# Altium schematic sheet ActuatorMKII_Connectors.SchDoc: Connectors
size B; Date: 09/17/2022; Author: Dylan Trainor; Organization: ORGANIZATION; Address1: ADDRESS 1; Address2: ADDRESS 2; Address3: ADDRESS 3; Address4: ADDRESS 4; DocumentNumber: 1; Revision: -; SheetNumber: 5; SheetTotal: 9; ENG_APP_DATE: --/--/--; DSN_APP_DATE: --/--/--; CHK_APP_DATE: --/--/--
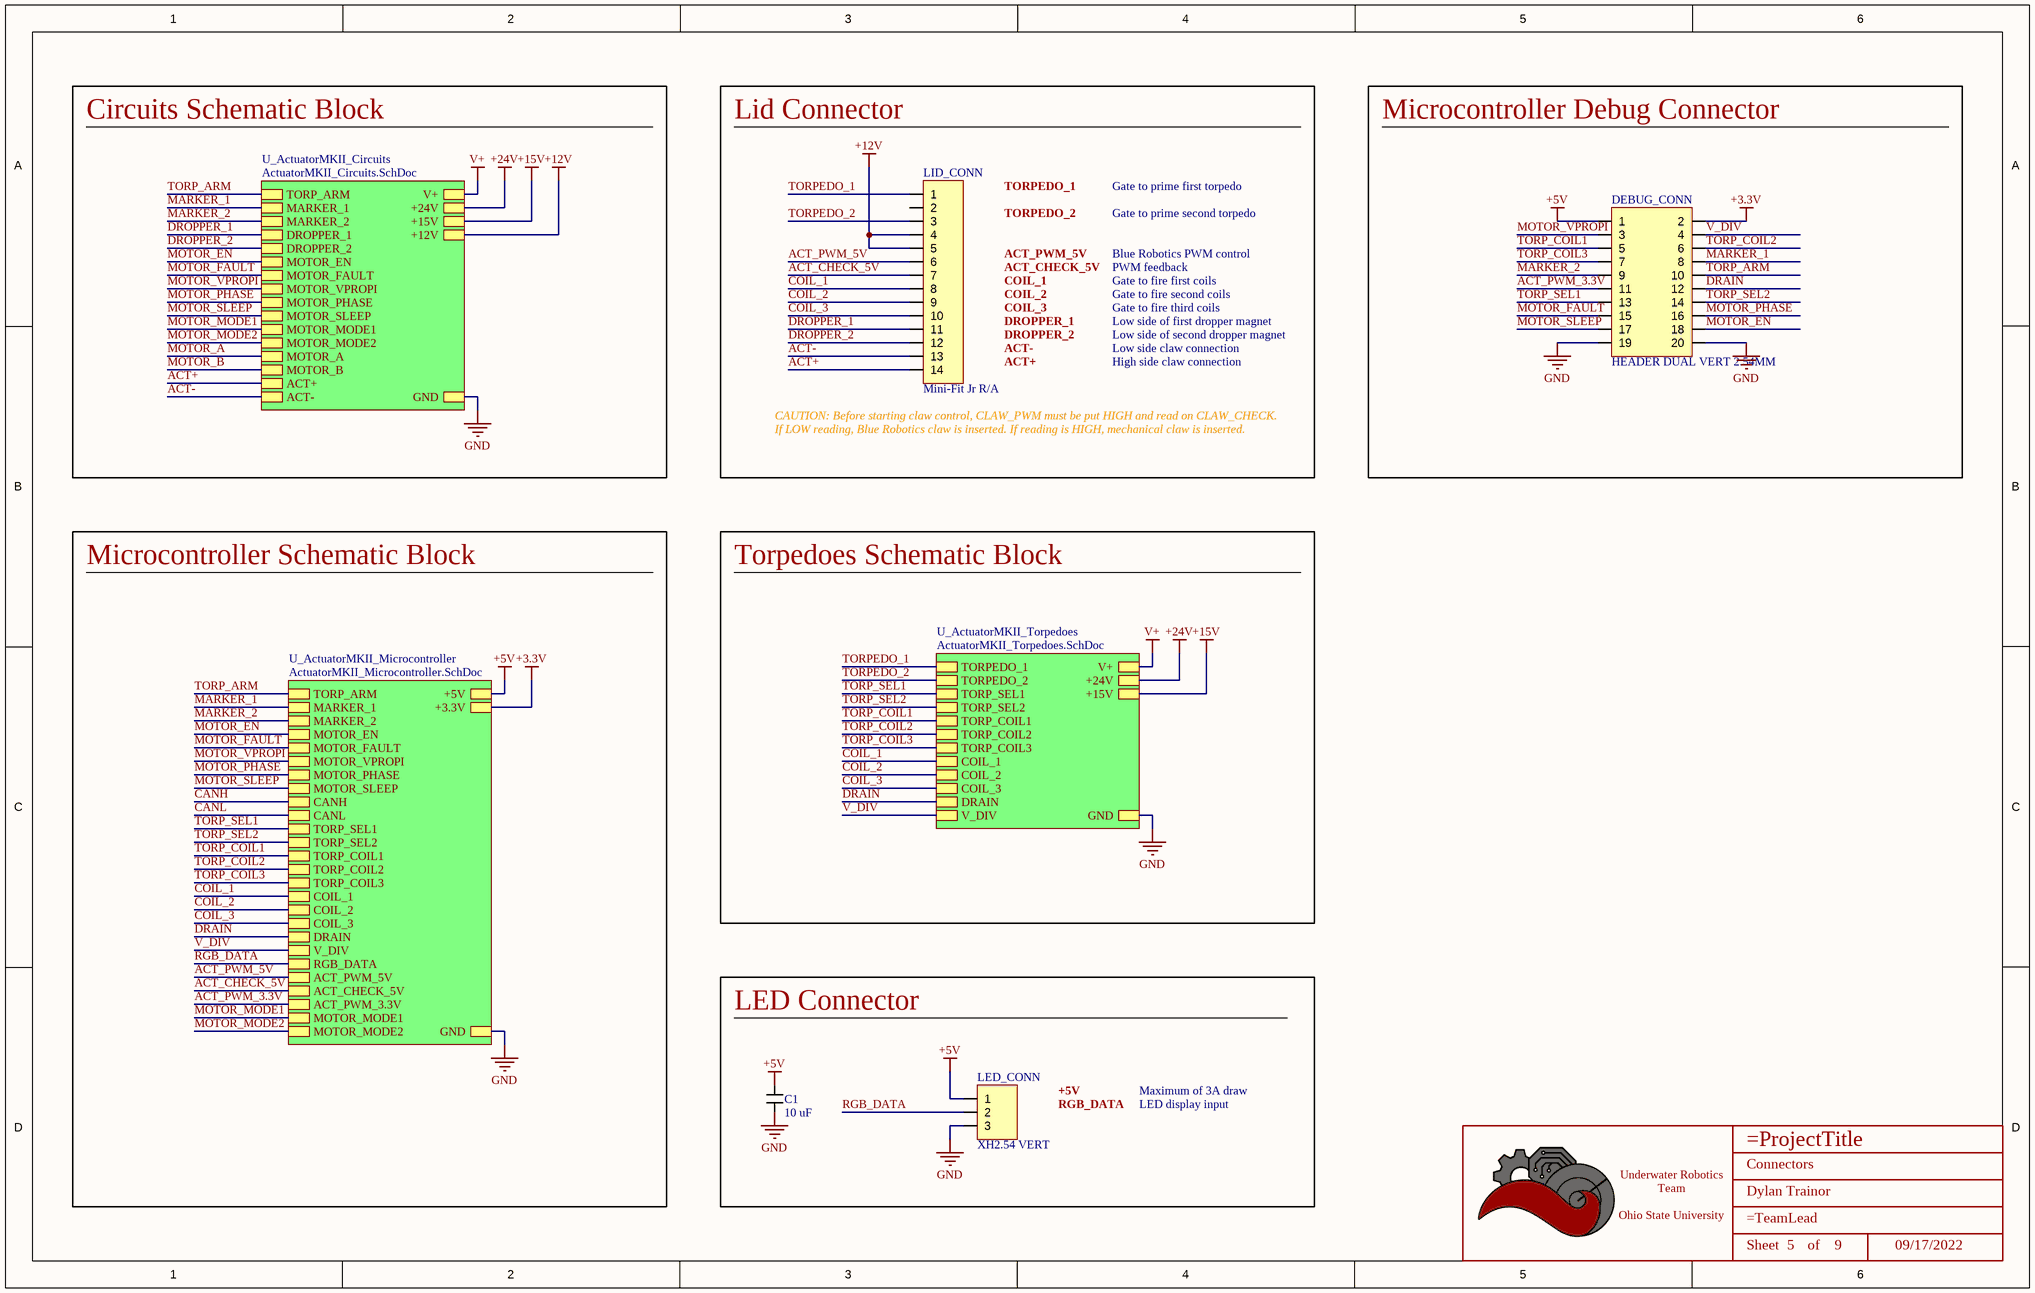
[diagram p0: ActuatorMKII_Connectors.SchDoc]

## Parts
*  Title_Block  [LOGO]  (value not drawn)  (graphical)
C1  Value (uF): 10 uF  [CAPACITOR_0603]  (hidden comment: 10uF Ceramic 6.3V)
DEBUG_CONN  HEADER DUAL VERT 2.54MM  [HEADER_2x10PIN_2.54MM]
LED_CONN  XH2.54 VERT  [CONN_JST_XH254_3POS_VERT]
LID_CONN  Mini-Fit Jr R/A  [CONN_MOLEX_MINIFIT JR_14 POS_R/A]

## Blocks framed on the sheet
Lid Connector: LID_CONN
Microcontroller Debug Connector: DEBUG_CONN
LED Connector: C1 LED_CONN

## Sub-sheets
U_ActuatorMKII_Circuits = ActuatorMKII_Circuits.SchDoc: V+, +15V, +12V, +24V, GND, TORP_ARM, MARKER_1, MARKER_2, DROPPER_1, DROPPER_2, MOTOR_EN, MOTOR_FAULT, MOTOR_VPROPI, MOTOR_PHASE, MOTOR_SLEEP, MOTOR_MODE1, MOTOR_MODE2, MOTOR_A, MOTOR_B, ACT+, ACT-
U_ActuatorMKII_Microcontroller = ActuatorMKII_Microcontroller.SchDoc: GND, +5V, +3.3V, TORP_ARM, MARKER_1, MARKER_2, MOTOR_EN, MOTOR_FAULT, MOTOR_VPROPI, MOTOR_PHASE, MOTOR_SLEEP, CANH, CANL, TORP_SEL1, TORP_SEL2, TORP_COIL1, TORP_COIL2, TORP_COIL3, COIL_1, COIL_2, COIL_3, DRAIN, V_DIV, RGB_DATA, ACT_PWM_5V, ACT_CHECK_5V, ACT_PWM_3.3V, MOTOR_MODE1, MOTOR_MODE2
U_ActuatorMKII_Torpedoes = ActuatorMKII_Torpedoes.SchDoc: V+, +15V, +24V, GND, TORPEDO_1, TORPEDO_2, TORP_SEL1, TORP_SEL2, TORP_COIL1, TORP_COIL2, TORP_COIL3, COIL_1, COIL_2, COIL_3, DRAIN, V_DIV

## Nets
+3.3V: DEBUG_CONN.2 ; sheet U_ActuatorMKII_Microcontroller/+3.3V
+5V: C1.1 DEBUG_CONN.1 LED_CONN.1 ; sheet U_ActuatorMKII_Microcontroller/+5V
+12V: LID_CONN.4 LID_CONN.5 ; sheet U_ActuatorMKII_Circuits/+12V
+15V: sheet U_ActuatorMKII_Circuits/+15V, sheet U_ActuatorMKII_Torpedoes/+15V
+24V: sheet U_ActuatorMKII_Circuits/+24V, sheet U_ActuatorMKII_Torpedoes/+24V
GND: C1.2 DEBUG_CONN.19 DEBUG_CONN.20 LED_CONN.3 ; sheet U_ActuatorMKII_Circuits/GND, sheet U_ActuatorMKII_Torpedoes/GND, sheet U_ActuatorMKII_Microcontroller/GND
V+: sheet U_ActuatorMKII_Circuits/V+, sheet U_ActuatorMKII_Torpedoes/V+
ACT+: LID_CONN.14 ; sheet U_ActuatorMKII_Circuits/ACT+
ACT-: LID_CONN.13 ; sheet U_ActuatorMKII_Circuits/ACT-
ACT_CHECK_5V: LID_CONN.7 ; sheet U_ActuatorMKII_Microcontroller/ACT_CHECK_5V
ACT_PWM_3.3V: DEBUG_CONN.11 ; sheet U_ActuatorMKII_Microcontroller/ACT_PWM_3.3V
ACT_PWM_5V: LID_CONN.6 ; sheet U_ActuatorMKII_Microcontroller/ACT_PWM_5V
CANH: sheet U_ActuatorMKII_Microcontroller/CANH
CANL: sheet U_ActuatorMKII_Microcontroller/CANL
COIL_1: LID_CONN.8 ; sheet U_ActuatorMKII_Torpedoes/COIL_1, sheet U_ActuatorMKII_Microcontroller/COIL_1
COIL_2: LID_CONN.9 ; sheet U_ActuatorMKII_Torpedoes/COIL_2, sheet U_ActuatorMKII_Microcontroller/COIL_2
COIL_3: LID_CONN.10 ; sheet U_ActuatorMKII_Torpedoes/COIL_3, sheet U_ActuatorMKII_Microcontroller/COIL_3
DRAIN: DEBUG_CONN.12 ; sheet U_ActuatorMKII_Torpedoes/DRAIN, sheet U_ActuatorMKII_Microcontroller/DRAIN
DROPPER_1: LID_CONN.11 ; sheet U_ActuatorMKII_Circuits/DROPPER_1
DROPPER_2: LID_CONN.12 ; sheet U_ActuatorMKII_Circuits/DROPPER_2
MARKER_1: DEBUG_CONN.8 ; sheet U_ActuatorMKII_Circuits/MARKER_1, sheet U_ActuatorMKII_Microcontroller/MARKER_1
MARKER_2: DEBUG_CONN.9 ; sheet U_ActuatorMKII_Circuits/MARKER_2, sheet U_ActuatorMKII_Microcontroller/MARKER_2
MOTOR_A: sheet U_ActuatorMKII_Circuits/MOTOR_A
MOTOR_B: sheet U_ActuatorMKII_Circuits/MOTOR_B
MOTOR_EN: DEBUG_CONN.18 ; sheet U_ActuatorMKII_Circuits/MOTOR_EN, sheet U_ActuatorMKII_Microcontroller/MOTOR_EN
MOTOR_FAULT: DEBUG_CONN.15 ; sheet U_ActuatorMKII_Circuits/MOTOR_FAULT, sheet U_ActuatorMKII_Microcontroller/MOTOR_FAULT
MOTOR_MODE1: sheet U_ActuatorMKII_Circuits/MOTOR_MODE1, sheet U_ActuatorMKII_Microcontroller/MOTOR_MODE1
MOTOR_MODE2: sheet U_ActuatorMKII_Circuits/MOTOR_MODE2, sheet U_ActuatorMKII_Microcontroller/MOTOR_MODE2
MOTOR_PHASE: DEBUG_CONN.16 ; sheet U_ActuatorMKII_Circuits/MOTOR_PHASE, sheet U_ActuatorMKII_Microcontroller/MOTOR_PHASE
MOTOR_SLEEP: DEBUG_CONN.17 ; sheet U_ActuatorMKII_Circuits/MOTOR_SLEEP, sheet U_ActuatorMKII_Microcontroller/MOTOR_SLEEP
MOTOR_VPROPI: DEBUG_CONN.3 ; sheet U_ActuatorMKII_Circuits/MOTOR_VPROPI, sheet U_ActuatorMKII_Microcontroller/MOTOR_VPROPI
RGB_DATA: LED_CONN.2 ; sheet U_ActuatorMKII_Microcontroller/RGB_DATA
TORP_ARM: DEBUG_CONN.10 ; sheet U_ActuatorMKII_Circuits/TORP_ARM, sheet U_ActuatorMKII_Microcontroller/TORP_ARM
TORP_COIL1: DEBUG_CONN.5 ; sheet U_ActuatorMKII_Torpedoes/TORP_COIL1, sheet U_ActuatorMKII_Microcontroller/TORP_COIL1
TORP_COIL2: DEBUG_CONN.6 ; sheet U_ActuatorMKII_Torpedoes/TORP_COIL2, sheet U_ActuatorMKII_Microcontroller/TORP_COIL2
TORP_COIL3: DEBUG_CONN.7 ; sheet U_ActuatorMKII_Torpedoes/TORP_COIL3, sheet U_ActuatorMKII_Microcontroller/TORP_COIL3
TORP_SEL1: DEBUG_CONN.13 ; sheet U_ActuatorMKII_Torpedoes/TORP_SEL1, sheet U_ActuatorMKII_Microcontroller/TORP_SEL1
TORP_SEL2: DEBUG_CONN.14 ; sheet U_ActuatorMKII_Torpedoes/TORP_SEL2, sheet U_ActuatorMKII_Microcontroller/TORP_SEL2
TORPEDO_1: LID_CONN.1 ; sheet U_ActuatorMKII_Torpedoes/TORPEDO_1
TORPEDO_2: LID_CONN.3 ; sheet U_ActuatorMKII_Torpedoes/TORPEDO_2
V_DIV: DEBUG_CONN.4 ; sheet U_ActuatorMKII_Torpedoes/V_DIV, sheet U_ActuatorMKII_Microcontroller/V_DIV

Not connected (* = marked no-connect by the designer): LID_CONN 2

## Notes on the sheet
- Circuits Schematic Block
- TORPEDO_1
- TORPEDO_2
- Gate to prime first torpedo
- Gate to prime second torpedo
- ACT_PWM_5V
- ACT_CHECK_5V
- COIL_1
- COIL_2
- Blue Robotics PWM control
- PWM feedback
- Gate to fire first coils
- Gate to fire second coils
- DROPPER_1
- DROPPER_2
- ACT+
- ACT-
- COIL_3
- Low side of first dropper magnet
- Low side of second dropper magnet
- High side claw connection
- Low side claw connection
- Gate to fire third coils
- (near LID_CONN) CAUTION: Before starting claw control, CLAW_PWM must be put HIGH and read on CLAW_CHECK.
- If LOW reading, Blue Robotics claw is inserted. If reading is HIGH, mechanical claw is inserted.
- Microcontroller Schematic Block
- Torpedoes Schematic Block
- RGB_DATA
- +5V
- LED display input
- Maximum of 3A draw
- DWG. NO.
- REV.
- SHT.
- THIS DOCUMENT AND THE DATA DISCLOSED HEREIN OR HEREWITH IS THE PROPERTY OF ALTIUM LIMITED AND MAY BE FREELY DISTRIBUTED IN WHOLE. NO RIGHTS ARE RESERVED OR EXPRESS OR IMPLIED WARANTEE GIVEN.
- REVISION
- DESCRIPTION
- DATE
- APPROVED
- ENG:
- APPROVALS
- PROJECT
- DSN:
- CHK:
- REFERENCE DOCUMENTS
- PROJECT REVISION:
- TITLE
- DOCUMENT REVISION:
- DESIGN ITEM:
- BOM:
- FAB DWG:
- PCB DWG:
- ASSY DWG:
- SCALE:
- SIZE
- B
- CAGE CODE
- FILE NAME
- DWG NO.
- SHEET
- OF
- REV
- (in symbol Title_Block) Underwater Robotics Team / Ohio State University; Sheet; of

## Library data of the parts
* = Title_Block: UWRT Schematic Title Block Template / Created June 2021, Dylan Trainor
C1 = CAPACITOR_10uF_0603: Cap 10uF 6.3V +/-20% / Ceramic 0603; Made By: Flip B; ComponentLink1Description: Digikey; ComponentLink1URL: https://www.digikey.com/en/products/detail/samsung-electro-mechanics/CL10A106MQ8NNNC/3886777; Supplier 1: Digi-Key; Supplier Part Number 1: 1276-1119-1-ND; Tolerance: +/- 20%; Voltage: 6.3V
DEBUG_CONN = HEADER_2x10PIN_2.54MM: CONN HEADER VERT 20POS 2.54MM; Made By: Tyson Nguyen; Supplier 1: Digi-Key; Supplier Part Number 1: Z8747-ND
LED_CONN = CONN_JST_XH254_3POS_VERT: JST XH 2.54mm Pitch 3 Pos Vertical; Current Per Pin: 4A; Number of Positions: 3; NOTE: Do not use JST 2.5mm parts with this footprint. JST does not make 2.54mm pitch pins, rather only clones make this connector!; Manufacturer: JST; Pitch: 2.54mm; Configuration: Vertical; Color: White; Created By: Robert P; Series: XH 2.54; ComponentLink1Description: Purchase Link; ComponentLink1URL: https://www.amazon.com/460PCS-XH2-54-Connector-Terminal-Connectors/dp/B09DBGVX5C
LID_CONN = CONN_MOLEX_MINIFIT JR_14POS_R/A: Molex Minifit Jr. 5569 / 14 Pos R/A Natural; Pitch: 4.2mm; Configuration: Right Angle; Current Per Pin: 13A; Number of Positions: 14; Manufacturer: Molex; Color: Natural; Created By: Flip B; ComponentLink1Description: Datasheet; ComponentLink1URL: https://www.molex.com/pdm_docs/ps/PS-5556-001.pdf; Series: Minifit Jr 5569; Supplier 1: Digi-Key; Supplier Part Number 1: WM21356-ND